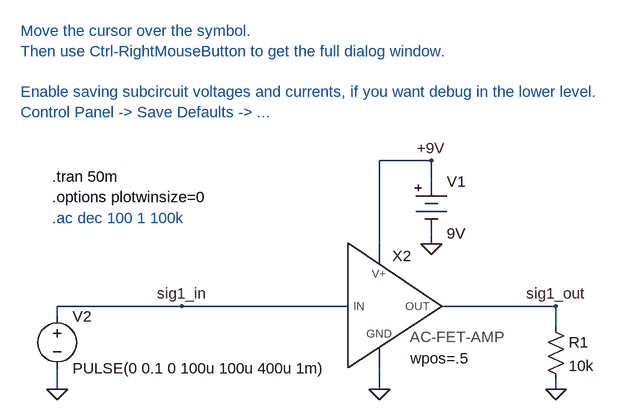
[diagram p0: schematic top_fetamp.asc]
top_fetamp.asc, the LTspice schematic file:
Version 4
SHEET 1 880 680
WIRE 224 16 144 16
WIRE 224 48 224 16
WIRE 144 144 144 16
WIRE 224 144 224 128
WIRE -160 240 -352 240
WIRE 96 240 -160 240
WIRE 416 240 240 240
WIRE -352 256 -352 240
WIRE 416 272 416 240
WIRE -352 368 -352 336
WIRE 144 368 144 336
WIRE 416 368 416 352
FLAG 144 368 0
FLAG 224 144 0
FLAG 224 16 +9V
FLAG 416 368 0
FLAG -352 368 0
FLAG -160 240 sig1_in
FLAG 416 240 sig1_out
SYMBOL Misc\\battery 224 32 R0
SYMATTR InstName V1
SYMATTR Value 9V
SYMBOL res 400 256 R0
SYMATTR InstName R1
SYMATTR Value 10k
SYMBOL voltage -352 240 R0
WINDOW 123 0 0 Left 0
WINDOW 39 0 0 Left 0
SYMATTR InstName V2
SYMATTR Value PULSE(0 0.1 0 100u 100u 400u 1m)
SYMBOL fetamp1 144 240 R0
SYMATTR InstName X2
SYMATTR SpiceLine wpos=.5
TEXT -360 40 Left 0 !.tran 50m
TEXT -360 72 Left 0 !.options plotwinsize=0
TEXT -360 104 Left 0 ;.ac dec 100 1 100k
TEXT -408 -184 Left 0 ;Move the cursor over the symbol. \nThen use Ctrl-RightMouseButton to get the full dialog window.\n \nEnable saving subcircuit voltages and currents, if you want debug in the lower level.\nControl Panel -> Save Defaults -> ...

The netlist it stands for:
* top_fetamp.asc
V1 +9V 0 9V
R1 sig1_out 0 10k
V2 sig1_in 0 PULSE(0 0.1 0 100u 100u 400u 1m)
XX2 sig1_in 0 sig1_out +9V fetamp1 params: wpos=.5  ; pins IN GND OUT V+
.tran 50m
.options plotwinsize=0
* .ac dec 100 1 100k
* Move the cursor over the symbol.
* Then use Ctrl-RightMouseButton to get the full dialog window.
* Enable saving subcircuit voltages and currents, if you want debug in the lower level.
* Control Panel -> Save Defaults -> ...
.backanno
.end